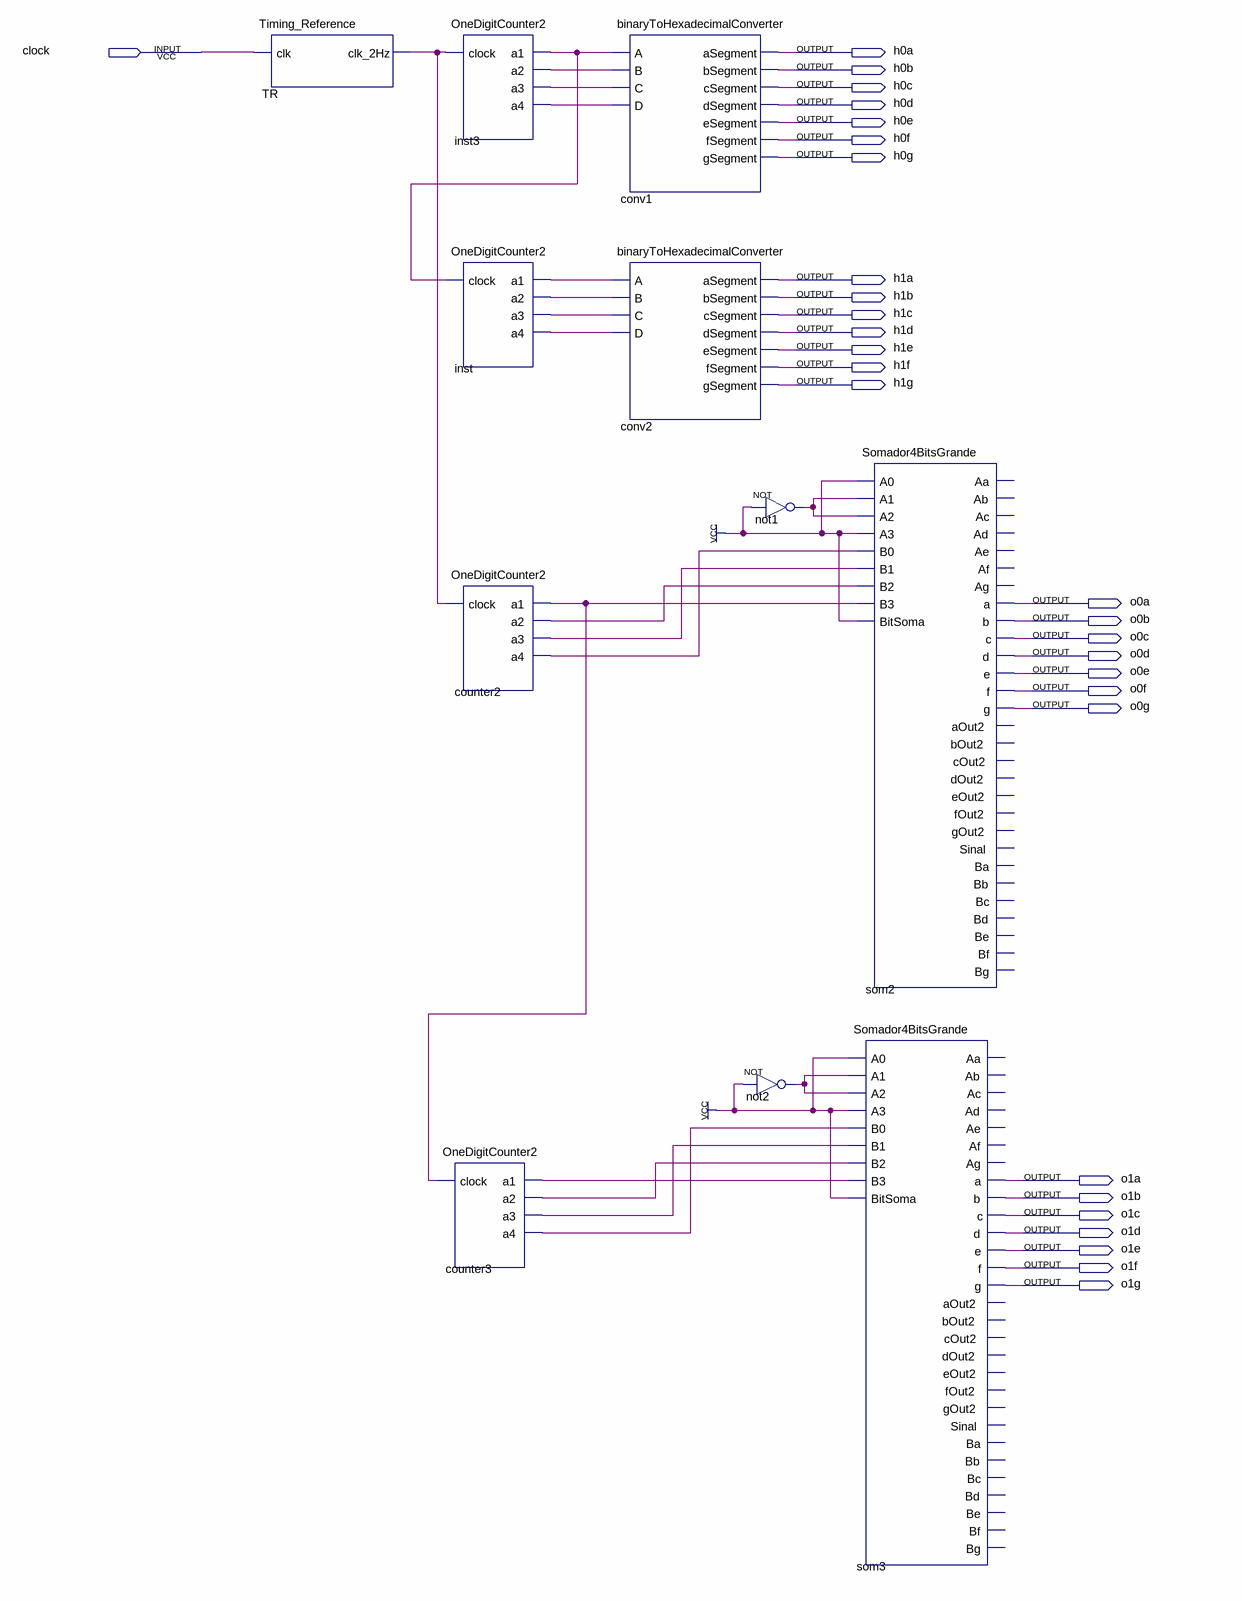
[diagram p0: schematic sheet]
// Quartus schematic fullCounter.bdf as structural Verilog: 11 symbols, 29 pins
module fullCounter (
  input  clock,
  output h0a,
  output h0b,
  output h0c,
  output h0d,
  output h0e,
  output h0f,
  output h0g,
  output h1a,
  output h1b,
  output h1c,
  output h1d,
  output h1e,
  output h1f,
  output h1g,
  output o0a,
  output o0b,
  output o0c,
  output o0d,
  output o0e,
  output o0f,
  output o0g,
  output o1a,
  output o1b,
  output o1c,
  output o1d,
  output o1e,
  output o1f,
  output o1g
);

  wire counter2_a1, counter2_a2, counter2_a3, counter2_a4, counter3_a1, counter3_a2, counter3_a3,
       counter3_a4, inst3_a1, inst3_a2, inst3_a3, inst3_a4, inst_a1, inst_a2, inst_a3, inst_a4, not1_out,
       not2_out, TR_clk_2hz;

  Timing_Reference TR (.clk(clock), .clk_2Hz(TR_clk_2hz));
  OneDigitCounter2 inst3 (.clock(TR_clk_2hz), .a1(inst3_a1), .a2(inst3_a2), .a3(inst3_a3), .a4(inst3_a4));
  OneDigitCounter2 inst (.clock(inst3_a1), .a1(inst_a1), .a2(inst_a2), .a3(inst_a3), .a4(inst_a4));
  OneDigitCounter2 counter2 (
    .clock(TR_clk_2hz), .a1(counter2_a1), .a2(counter2_a2), .a3(counter2_a3), .a4(counter2_a4));
  OneDigitCounter2 counter3 (
    .clock(counter2_a1), .a1(counter3_a1), .a2(counter3_a2), .a3(counter3_a3), .a4(counter3_a4));
  binaryToHexadecimalConverter conv1 (
    .A(inst3_a1), .B(inst3_a2), .C(inst3_a3), .D(inst3_a4), .aSegment(h0a), .bSegment(h0b), .cSegment(h0c),
    .dSegment(h0d), .eSegment(h0e), .fSegment(h0f), .gSegment(h0g));
  binaryToHexadecimalConverter conv2 (
    .A(inst_a1), .B(inst_a2), .C(inst_a3), .D(inst_a4), .aSegment(h1a), .bSegment(h1b), .cSegment(h1c),
    .dSegment(h1d), .eSegment(h1e), .fSegment(h1f), .gSegment(h1g));
  not not1 (not1_out, 1'b1);
  not not2 (not2_out, 1'b1);
  Somador4BitsGrande som2 (
    .A0(1'b1), .A1(not1_out), .A2(not1_out), .A3(1'b1), .B0(counter2_a4), .B1(counter2_a3), .B2(counter2_a2),
    .B3(counter2_a1), .BitSoma(1'b1), .a(o0a), .b(o0b), .c(o0c), .d(o0d), .e(o0e), .f(o0f), .g(o0g));  // open: Aa, Ab, Ac, Ad, Ae, Af, Ag, aOut2, bOut2, cOut2, dOut2, eOut2, fOut2, gOut2, Sinal, Ba, Bb, Bc, Bd, Be, Bf, Bg
  Somador4BitsGrande som3 (
    .A0(1'b1), .A1(not2_out), .A2(not2_out), .A3(1'b1), .B0(counter3_a4), .B1(counter3_a3), .B2(counter3_a2),
    .B3(counter3_a1), .BitSoma(1'b1), .a(o1a), .b(o1b), .c(o1c), .d(o1d), .e(o1e), .f(o1f), .g(o1g));  // open: Aa, Ab, Ac, Ad, Ae, Af, Ag, aOut2, bOut2, cOut2, dOut2, eOut2, fOut2, gOut2, Sinal, Ba, Bb, Bc, Bd, Be, Bf, Bg
endmodule
